# Altium schematic sheet DrivenOutputs.SchDoc
size A
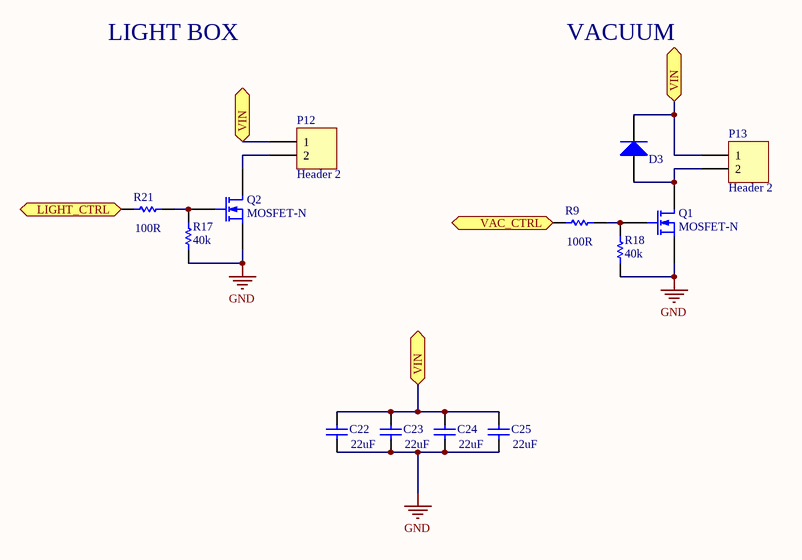
[diagram p0: DrivenOutputs.SchDoc]

## Parts
C22  value 22uF  [0805]  (hidden comment: Cap)
C23  value 22uF  [0805]  (hidden comment: Cap)
C24  value 22uF  [0805]  (hidden comment: Cap)
C25  value 22uF  [0805]  (hidden comment: Cap)
D3  Diode MMBD914  [SOT-23]  (value not drawn)
P12  Header 2  [HDR1X2]
P13  Header 2  [HDR1X2]
Q1  MOSFET-N  [DPAK]
Q2  MOSFET-N  [DPAK]
R9  value 100R  [0805]  (hidden comment: Res1)
R17  value 40k  [0805]  (hidden comment: Resistor)
R18  value 40k  [0805]  (hidden comment: Resistor)
R21  value 100R  [0805]  (hidden comment: Res1)

## Ports
LIGHT_CTRL, VAC_CTRL, VIN

## Nets
GND: C22.1 C23.1 C24.1 C25.1 Q1.3(S) Q2.3(S) R17.1 R18.1
LIGHT_CTRL: R21.1 ; port LIGHT_CTRL
VAC_CTRL: R9.1 ; port VAC_CTRL
VIN: C22.2 C23.2 C24.2 C25.2 D3.3(K) P12.1 P13.1 ; port VIN
NetD3_1: D3.1(A) P13.2 Q1.2(D)
NetP12_2: P12.2 Q2.2(D)
NetQ1_1: Q1.1(G) R9.2 R18.2
NetQ2_1: Q2.1(G) R17.2 R21.2

## Notes on the sheet
- LIGHT BOX
- VACUUM

## Library data of the parts
C22-C25 = Cap: Capacitor; Published: 8-Jun-2000; LatestRevisionDate: 17-Jul-2002; LatestRevisionNote: Re-released for DXP Platform.; PackageReference: RAD-0.3; Publisher: Altium Limited; PackageDescription: Radial Cap, Thru-Hole; 2 Leads; 0.3 in Pin Spacing
D3 = Diode MMBD914: Standard Diode; Manufacturer Part No.: MMBD914LT1G; Vf: 1V; Imax: 200mA; Vreverse: 100V; Digi-Key Part No.: MMBD914LT1GOSCT-ND
P12 P13 = Header 2: Header, 2-Pin; LatestRevisionDate: 17-Jul-2002; LatestRevisionNote: Re-released for DXP Platform.; Publisher: Altium Limited
Q1 Q2 = N-Channel MOSFET: Manufacturer Part No.: STD5NK40ZT4; Max. Vds: 400V; Max. Id: 3A; Digi-Key Part No.: 497-2477-1-ND
R9 R21 = Res1: Resistor; Published: 8-Jun-2000; LatestRevisionDate: 17-Jul-2002; LatestRevisionNote: Re-released for DXP Platform.; PackageReference: AXIAL-0.3; Publisher: Altium Limited; PackageDescription: Axial Device, Thru-Hole; 2 Leads; 0.3 in Pin Spacing
R17 R18 = Resistor: Chip Resistor